# EAGLE design RFM69 USB Gateway 0.9 (EAGLE 7.7.0)
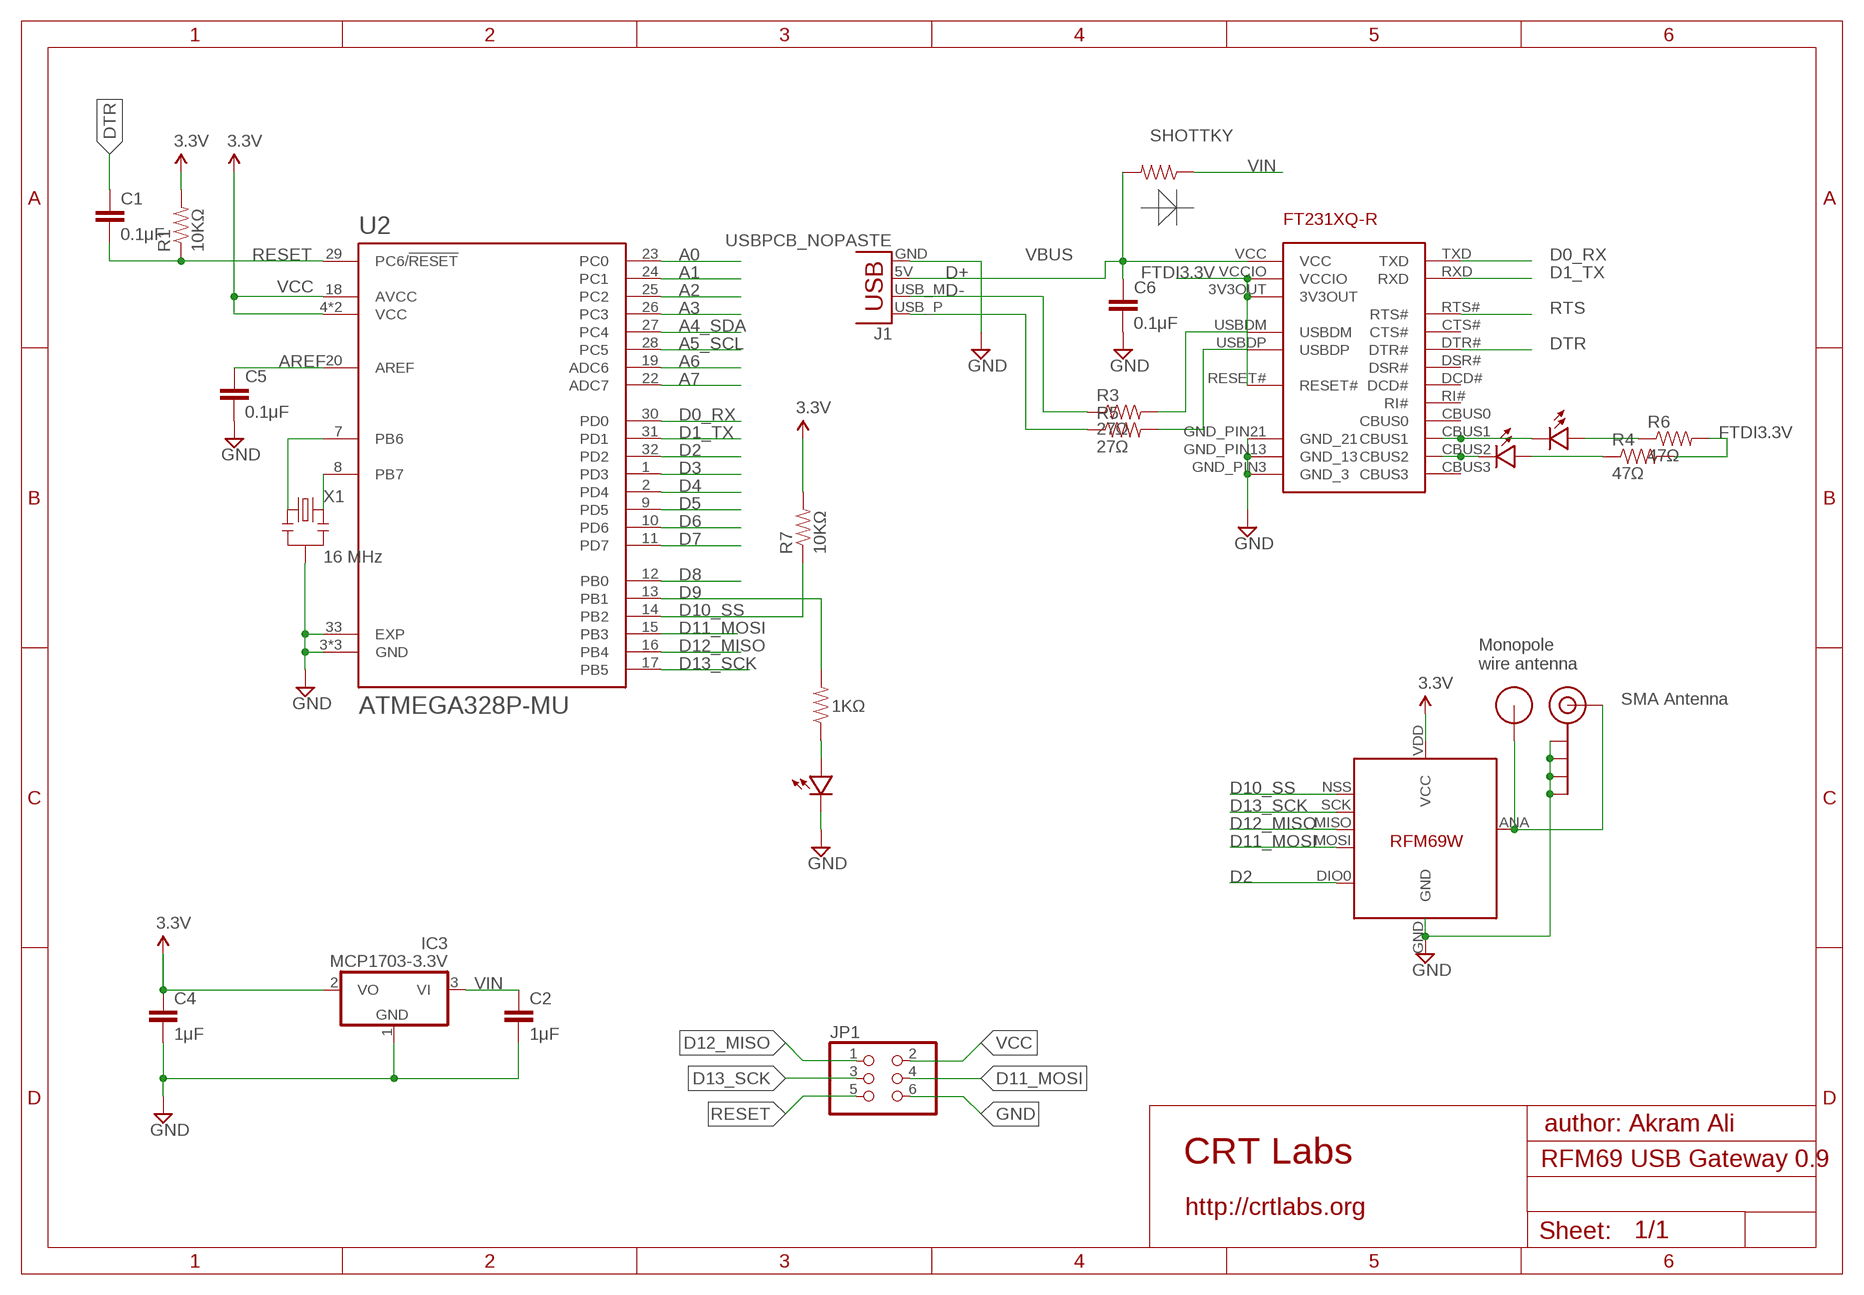
[diagram p0: schematic, sheet 1]

## Parts
C1  0.1μF  CAP0805  [0805]
C2  1μF  CAP0805  [0805]
C4  1μF  CAP0805  [0805]
C5  0.1μF  CAP0805  [0805]
C6  0.1μF  CAP0805  [0805]
D  SHOTTKY  RESISTOR0805  [0805]
FT231XQ-R  FT231XQ-R  [FTDI_FT231XQ-R_PACKAGE]
IC3  MCP1703-3.3V  MCP1703CB  [SOT23]
J1  USBPCB_NOPASTE  [USB-A-PCB-NOPASTE]
J$1  SMA_EDGE  [SMA-EDGE]
JP1  PINHD-2X3  [2X03]
R1  10KΩ  RESISTOR0805  [0805]
R2  1KΩ  RESISTOR0805-RES  [0805]
R3  27Ω  RESISTOR0805-RES  [0805]
R4  47Ω  RESISTOR0805-RES  [0805]
R5  27Ω  RESISTOR0805-RES  [0805]
R6  47Ω  RESISTOR0805-RES  [0805]
R7  10KΩ  RESISTOR0805-RES  [0805]
RX  Green  LED0805  [0805-LED]
TX  Red  LED0805  [0805-LED]
U2  ATMEGA328P-MU  [QFN50P500X500X100-33N]
U$1  RFM12B_ANTENNA  [RFM12B-ANTENNA]
U$2  Status  LED0805  [0805-LED]
U$5  RFM69  [RFM69W-MINPADS]
X1  16 MHz  RESONATORSMD  [RESONATOR-SMD]

## Nets
A0: U2.23(PC0)
A1: U2.24(PC1)
A2: U2.25(PC2)
A3: U2.26(PC3)
A4_SDA: U2.27(PC4)
A5_SCL: U2.28(PC5)
A6: U2.19(ADC6)
A7: U2.22(ADC7)
AREF: C5.1 U2.20(AREF)
D0_RX: FT231XQ-R.TXD U2.30(PD0)
D1_TX: FT231XQ-R.RXD U2.31(PD1)
D2: U2.32(PD2) U$5.DIO0
D3: U2.1(PD3)
D4: U2.2(PD4)
D5: U2.9(PD5)
D6: U2.10(PD6)
D7: U2.11(PD7)
D8: U2.12(PB0)
D9: R2.2 U2.13(PB1)
D10_SS: R7.1 U2.14(PB2) U$5.NSS(SEL)
D11_MOSI: JP1.4 U2.15(PB3) U$5.MOSI
D12_MISO: JP1.1 U2.16(PB4) U$5.MISO
D13_SCK: JP1.3 U2.17(PB5) U$5.SCK
D+: J1.USB_P(D+) R5.1
D-: J1.USB_M(D-) R3.1
DTR: C1.1 FT231XQ-R.DTR#
FTDI3.3V: FT231XQ-R.3V3OUT FT231XQ-R.RESET# FT231XQ-R.VCCIO R4.2 R6.2
GND [power]: C2.2 C4.2 C5.2 C6.2 FT231XQ-R.GND_PIN3(GND_3) FT231XQ-R.GND_PIN13(GND_13) FT231XQ-R.GND_PIN21(GND_21) IC3.1(GND) J1.GND J$1.GND@0(GND) J$1.GND@1(GND) J$1.GND@2(GND) J$1.GND@3(GND) JP1.6 U2.3(GND) U2.5(GND) U2.21(GND) U2.33(EXP) U$2.MINUS U$5.GND X1.2
N$1: U2.7(PB6) X1.1
N$2: R2.1 U$2.PLUS
N$3: J$1.SIG(SIGNAL) U$1.P$1 U$5.ANA(ANT)
N$4: FT231XQ-R.USBDM R3.2
N$5: FT231XQ-R.USBDP R5.2
N$6: FT231XQ-R.CBUS1 RX.MINUS
N$7: FT231XQ-R.CBUS2 TX.MINUS
N$8: R4.1 TX.PLUS
N$9: R6.1 RX.PLUS
N$21: U2.8(PB7) X1.3
RESET: C1.2 JP1.5 R1.1 U2.29(PC6/!RESET)
RTS: FT231XQ-R.RTS#
VBUS [power]: C6.1 D.2 FT231XQ-R.VCC J1.5V(VBUS)
VCC: C4.1 IC3.2(VO) JP1.2 R1.2 R7.2 U2.4(VCC) U2.6(VCC) U2.18(AVCC) U$5.VDD(VCC) ; supply symbol labelled 3.3V
VIN: C2.1 D.1 IC3.3(VI)
Unconnected: FT231XQ-R.CBUS0 FT231XQ-R.CBUS3 FT231XQ-R.CTS# FT231XQ-R.DCD# FT231XQ-R.DSR# FT231XQ-R.RI#

## Notes on the sheet
- Monopole
  wire antenna
- SMA Antenna
- author: Akram Ali
- CRT Labs
- http://crtlabs.org

## Library data of the parts
C1 C2 C5 C6 = SparkFun:CAP: Capacitor Standard 0603 ceramic capacitor, and 0.1" leaded capacitor.
C4 = LowPowerLab:CAP: Capacitor Standard 0603 ceramic capacitor, and 0.1" leaded capacitor.
D R1 = LowPowerLab:RESISTOR: Resistor Basic schematic elements and footprints for 0603, 1206, and PTH resistors.
FT231XQ-R = ftdi_ft231xq-r:FT231XQ-R: This is the 20-LD QFN package of the FTDI FT231XQ-R chip.
IC3 = linear:MCP1703: 250 mA, 16V, Low Quiescent Current LDO Regulator Source: http://ww1.microchip.com/downloads/en/DeviceDoc/22049b.pdf
J1 = SparkFun-Connectors:USB: USB Connectors USB-B-PTH is fully proven SKU : PRT-00139/CONN-08278 USB-miniB is fully proven SKU : PRT-00587 USB-A-PCB is untested. USB-A-H is throughly reviewed, but untested. Spark Fun Electronics SKU : PRT-00437 USB-B-SMT is throughly reviewed, but untested. Needs silkscreen touching up. USB-A-S has not been used/tested USB-MB-H has not been used/tested USB-MICROB has been used. CONN-09505
J$1 = SparkFun-Connectors:SMA_EDGE: SMA Antenna Connector End launch SMA connector. The paste layer has been removed so that the connector can be hand soldered onto the board after reflow.
JP1 = pinhead:PINHD-2X3: PIN HEADER
R2-R7 = SparkFun:RESISTOR: Resistor Basic schematic elements and footprints for 0603, 1206, and PTH resistors.
RX TX U$2 = LowPowerLab:LED
U2 = ATMEGA328P-MU:ATMEGA328P-MU: ATmega Series 20 MHz 32 KB Flash 2 KB SRAM 8-Bit Microcontroller - QFN-32; AVAILABILITY: Good; DESCRIPTION: ATmega Series 20 MHz 32 KB Flash 2 KB SRAM 8-Bit Microcontroller - QFN-32; MF: Atmel; MP: ATMEGA328P-MU; PACKAGE: QFN-32 Atmel; PRICE: 2.55 USD
U$1 = LowPowerLab:RFM12B_ANTENNA
U$5 = LowPowerLab:RFM69
X1 = SparkFun:RESONATOR: Resonator Small SMD resonator. This is the itty bitty 10/20MHz resonators with built in caps. CSTCE10M0G55 and CSTCE20M0V53. Footprint has been reviewed closely but hasn't been tested yet.

## Net classes
1 power: width 0.381 mm, clearance 0.254 mm

## Board
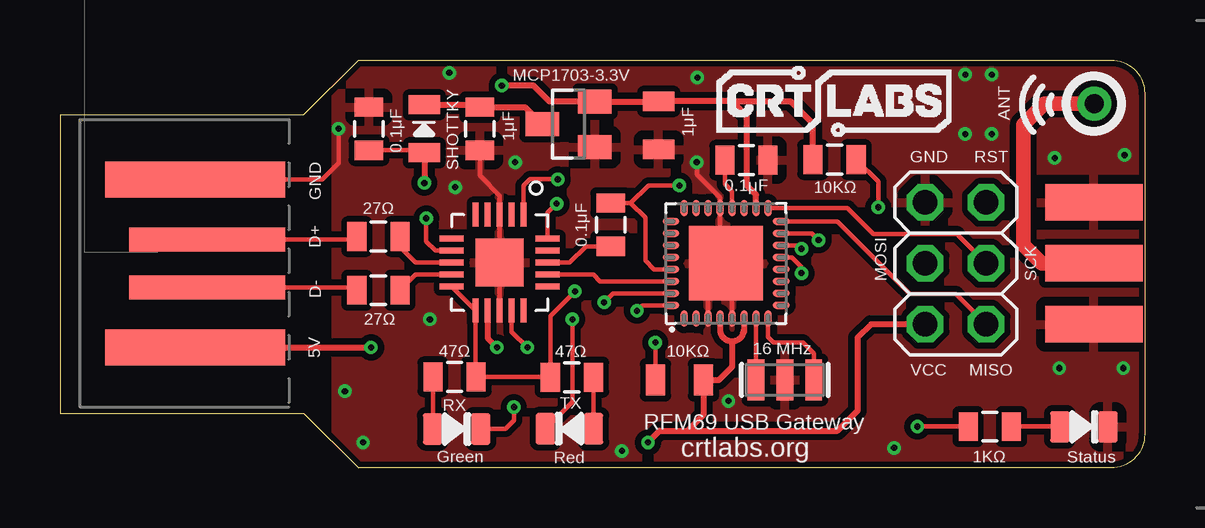
[diagram p1: board, top side]
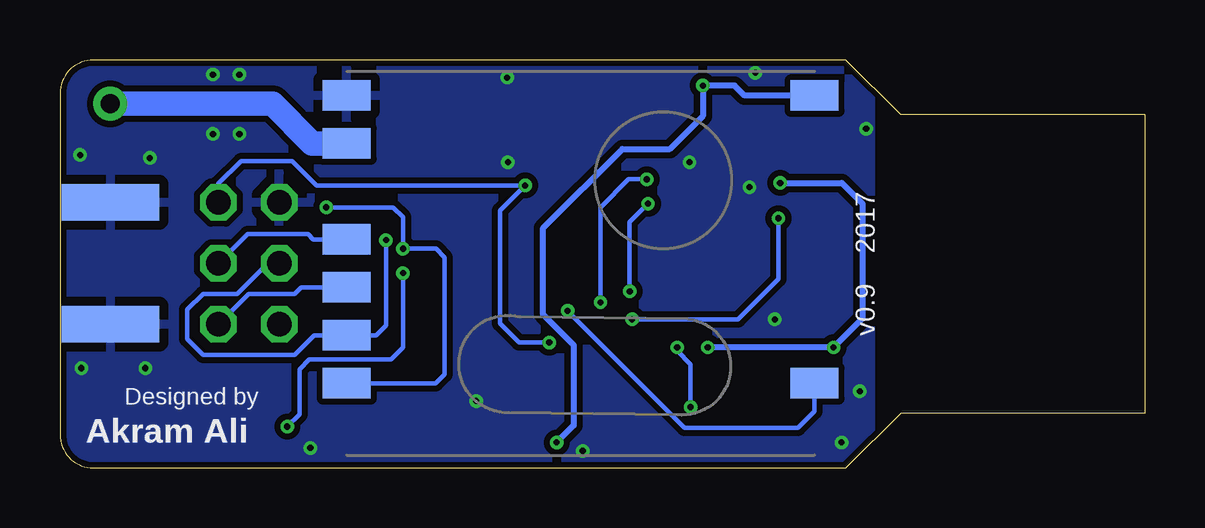
[diagram p2: board, bottom side, seen from below]

Size 45.21 x 17.02 mm. Coordinates in mm from the lower left corner, seen from the top.
Outline: 0,2.29 10.16,2.29 12.45,0 43.81,0 arc90 45.21,1.4 45.21,15.62 arc90 43.81,17.02 12.45,17.02 10.16,14.73 0,14.73 0,2.29
Copper layers (1*16): Top 0.035mm / dielectric 1.5mm / Bottom 0.035mm
Design rules "ITEADstudio_DRC *": minimum track width 6mil, minimum drill 12mil, track to track 6mil, track to pad 6mil, pad to pad 6mil, via to via 6mil, smd to smd 0mil, copper to edge 10mil, drill to drill 10mil, minimum pad ring 10mil, minimum via ring 6mil, stop-mask expansion 2mil, vias tented up to drill 100mil, thermal gap 15mil

### Footprints (pad centres in the part's own frame; a part is rotated, then mirrored left to right if it is on the bottom)
0805 = smd 0.8 x 1.2: 1 -0.9,0; 2 0.9,0
0805' = smd 0.8 x 1.3: 1 -1,0; 2 1,0
FTDI_FT231XQ-R_PACKAGE = smd 0.25 x 1: 3V3OUT 0.968,-2.032; CBUS2 -0.532,-2.032; CBUS3 0.968,1.968; CTS# -1.032,-2.032; DTR# -0.032,1.968; RTS# -0.532,1.968; TXD 0.468,1.968; USBDM 0.468,-2.032; USBDP -0.032,-2.032; VCCIO -1.032,1.968 | smd 1 x 0.25: CBUS0 1.968,0.968; CBUS1 1.968,0.468; DCD# -2.032,-1.032; DSR# -2.032,-0.532; GND_PIN3 -2.032,-0.032; GND_PIN13 1.968,-0.032; RESET# 1.968,-1.032; RI# -2.032,0.468; RXD -2.032,0.968; VCC 1.968,-0.532 | smd 2 x 2: GND_PIN21 -0.032,-0.032
SOT23 = smd 1 x 1.4: 1 -0.95,-1.1; 2 0.95,-1.1; 3 0,1.1
USB-A-PCB-NOPASTE = smd 7.5 x 1.5: 5V -0.2,-3.5; GND -0.2,3.5 | smd 6.5 x 1: USB_M 0.3,-1; USB_P 0.3,1
SMA-EDGE = smd 1.524 x 4.064: GND@0 0,0; GND@1 5.08,0; SIG 2.54,0 | smd 1.524 x 4.064 bottom: GND@2 0,0; GND@3 5.08,0
2X03 = drill 1.016 octagon: 1 -2.54,-1.27; 2 -2.54,1.27; 3 0,-1.27; 4 0,1.27; 5 2.54,-1.27; 6 2.54,1.27
0805-LED = smd 0.8 x 1.3: MINUS -1,0; PLUS 1,0
QFN50P500X500X100-33N = smd 0.7 x 0.3: 1 -2.3,1.75; 2 -2.3,1.25; 3 -2.3,0.75; 4 -2.3,0.25; 5 -2.3,-0.25; 6 -2.3,-0.75; 7 -2.3,-1.25; 8 -2.3,-1.75; 17 2.3,-1.75; 18 2.3,-1.25; 19 2.3,-0.75; 20 2.3,-0.25; 21 2.3,0.25; 22 2.3,0.75; 23 2.3,1.25; 24 2.3,1.75 | smd 0.3 x 0.7: 9 -1.75,-2.3; 10 -1.25,-2.3; 11 -0.75,-2.3; 12 -0.25,-2.3; 13 0.25,-2.3; 14 0.75,-2.3; 15 1.25,-2.3; 16 1.75,-2.3; 25 1.75,2.3; 26 1.25,2.3; 27 0.75,2.3; 28 0.25,2.3; 29 -0.25,2.3; 30 -0.75,2.3; 31 -1.25,2.3; 32 -1.75,2.3 | smd 3.1 x 3.1: 33 0,0
RFM12B-ANTENNA = drill 0.8 pad 1.422: P$1 0,0
RFM69W-MINPADS = smd 2 x 1.27: ANA 8,-5; DIO0 -11.5,5; GND 8,-7; MISO 8,1; MOSI 8,3; NSS 8,5; SCK 8,-1; VDD -11.5,-7
RESONATOR-SMD = smd 0.7 x 1.7: 1 -1.2,0; 2 0,0; 3 1.2,0

### Placement (x,y rotation side)
C1  22.96,10.15 90 top
C2  17.5,14.15 270 top
C4  1μF  [0805']  24.96,14.29 270 top
C5  28.61,12.84 0 top
C6  12.88,14.15 90 top
D  SHOTTKY  [0805']  15.19,14.15 270 top
FT231XQ-R  18.36,8.53 270 top
IC3  21.2,14.34 90 top
J1  5.84,8.53 0 top
J$1  43.1,5.99 90 top
JP1  37.34,8.53 90 top
R1  10KΩ  [0805']  25.82,3.67 0 top
R2  38.76,1.73 180 top
R3  13.27,7.42 0 top
R4  21.34,3.78 180 top
R5  13.27,9.65 0 top
R6  16.45,3.8 0 top
R7  32.28,12.87 180 top
RX  16.54,1.63 180 top
TX  21.23,1.64 0 top
U2  27.76,8.53 90 top
U$1  43.12,15.19 0 top
U$2  42.68,1.71 180 top
U$5  25.26,8.53 180 bottom
X1  30.21,3.67 0 top

### Tracks (layer width: path | path; a pad name or v marks a point on that pad's centre or on a via)
AREF
  Top 0.178: U2.20 28.01,11.54 27.71,11.84 C5.1
D0_RX
  Top 0.178: U2.30 22.52,7.78 22.24,8.07 FT231XQ-R.TXD
D1_TX  (via drill 0.25 pad 0.13)
  Top 0.178: U2.31 23.06,7.28 v22.68,6.91 | FT231XQ-R.RXD 19.33,11.79 19.58,12.04 v20.75,12.04
  Bottom 0.178: v22.68,6.91 22.68,10.87 21.51,12.04 v20.75,12.04
D2  (via drill 0.25 pad 0.13)
  Top 0.178: U2.32 24.28,6.78 v24.05,6.55
  Bottom 0.178: U$5.DIO0 13.76,2.37 14.45,1.68 19.18,1.68 v24.05,6.55
D9  (via drill 0.25 pad 0.13)
  Top 0.178: U2.13 30.51,8.78 30.91,8.38 v30.91,8.13 | v35.74,1.73 R2.2
  Bottom 0.178: v30.91,8.13 30.91,5.03 31.42,4.52 34.82,4.52 35.23,4.12 35.23,2.24 v35.74,1.73
D10_SS  (via drill 0.25 pad 0.13)
  Top 0.178: U2.14 30.77,9.28 v30.91,9.14 | R7.1 34.11,11.94 v34.11,10.87
  Bottom 0.178: U$5.NSS 29.56,3.53 29.18,3.91 29.18,8.79 29.54,9.14 v30.91,9.14 30.91,10.46 31.32,10.87 v34.11,10.87
D11_MOSI  (via drill 0.25 pad 0.13)
  Top 0.178: U2.15 31.34,9.78 v31.62,9.5
  Bottom 0.178: JP1.4 36.55,8.53 37.82,7.26 39.24,7.26 39.9,6.6 39.9,5.38 39.24,4.72 35.43,4.72 34.62,5.54 U$5.MOSI 32.03,5.54 31.62,5.94 v31.62,9.5
D12_MISO
  Top 0.178: U2.16 32.41,10.28 35.43,7.26 37.34,7.26 JP1.1
  Bottom 0.178: U$5.MISO 35.16,7.53 35.43,7.26 37.34,7.26 JP1.1
D13_SCK
  Top 0.178: JP1.3 37.39,9.75 33.91,9.75 32.83,10.83 U2.17
  Bottom 0.178: U$5.SCK 34.66,9.53 34.87,9.75 37.39,9.75 JP1.3
D+
  Top 0.178: R5.1 12.25,9.53 J1.USB_P
D-
  Top 0.178: R3.1 12.25,7.53 J1.USB_M
DTR
  Top 0.178: FT231XQ-R.DTR# 21.24,8.57 21.92,9.25 C1.1
FTDI3.3V  (via drill 0.25 pad 0.13)
  Top 0.178: FT231XQ-R.3V3OUT FT231XQ-R.RESET# 17.33,3.81 R6.2 20.42,3.8 R4.2 20.45,3.8 20.45,6.35 v21.46,7.37 | FT231XQ-R.VCCIO 20.33,10.65 v20.7,11.02
  Bottom 0.178: v21.46,7.37 21.46,10.26 v20.7,11.02
GND  (via drill 0.25 pad 0.13)
  Top 0.178: FT231XQ-R.GND_PIN13 FT231XQ-R.GND_PIN21 FT231XQ-R.GND_PIN3 18.33,11.36 17.5,12.19 C2.2 | U2.33 27.51,8.78 U2.21 27.51,11.27 26.54,12.24 v26.54,12.75 | U2.5 28.01,8.28 U2.33 | U2.3 27.01,7.78 U2.33 | J1.GND 10.92,12.03 11.61,12.72 v11.61,14.15
  other vias: 27.86,2.79 18.97,12.75 11.87,3.2 44.32,4.17 44.37,13.06 15.42,6.2 37.73,16.41 38.84,16.41 26.57,16.28 16.23,16.48 12.64,1.07 23.42,0.71 34.77,0.84 41.66,4.17 41.47,12.93 16.47,11.71 38.84,13.93 37.73,13.93
  pour Bottom: 11.43,16.89 11.43,-0.13 46.23,-0.01 46.23,17.01
  pour Top: 11.48,16.85 11.48,-0.17 46.08,-0.09 46.08,16.93
N$1
  Top 0.178: U2.7 X1.1
N$2
  Top 0.178: R2.1 41.67,1.73 U$2.PLUS
N$3
  Top 0.61: J$1.SIG 40.92,8.53 40.16,9.3 40.16,14.33 41.02,15.19 U$1.P$1
  Bottom 1.016: U$5.ANA 34.69,13.53 36.35,15.19 U$1.P$1
N$4
  Top 0.178: FT231XQ-R.USBDM 14.82,8.07 R3.2
N$5
  Top 0.178: FT231XQ-R.USBDP 14.83,8.57 14.17,9.22 R5.2
N$6  (via drill 0.25 pad 0.13)
  Top 0.178: FT231XQ-R.CBUS1 18.83,5.68 v19.48,5.03 | RX.MINUS 18.57,1.63 18.92,1.98 v18.92,2.54
  Bottom 0.178: v19.48,5.03 19.48,4.88 18.92,4.32 v18.92,2.54
N$7  (via drill 0.25 pad 0.13)
  Top 0.178: FT231XQ-R.CBUS2 15.65,9.07 15.26,9.45 v15.26,10.41 | TX.MINUS 21.36,2.76 v21.36,6.2
  Bottom 0.178: v15.26,10.41 15.26,7.87 16.94,6.2 v21.36,6.2
N$8
  Top 0.178: TX.PLUS R4.1
N$9
  Top 0.178: R6.1 15.55,1.64 RX.PLUS
N$21
  Top 0.178: U2.8 29.51,5.46 29.74,5.23 30.96,5.23 31.42,4.78 X1.3
RESET  (via drill 0.25 pad 0.13)
  Top 0.178: U2.29 24.76,8.28 24.4,8.65 24.4,10.44 23.79,11.05 | C1.2 23.79,11.05 | R1.1 v24.82,5.23 | v25.82,11.79 24.53,11.79 23.79,11.05
  Bottom 0.178: JP1.5 38.61,11.86 37.67,12.8 35.53,12.8 34.52,11.79 v25.82,11.79 26.87,10.73 26.87,6.02 26.09,5.23 v24.82,5.23
VBUS  (via drill 0.25 pad 0.13)
  Top 0.178: C6.1 15.09,13.25 D.2 | J1.5V
  Top 0.254: FT231XQ-R.VCC 17.83,5.41 v18.21,5.03 | D.2 v15.19,11.89 | J1.5V v12.97,5.03
  Bottom 0.254: v15.19,11.89 12.62,11.89 11.76,11.02 11.76,6.24 v12.97,5.03 v18.21,5.03
VCC  (via drill 0.25 pad 0.13)
  Top 0.178: C4.1 | R1.2 26.83,3.66 | 28.51,5.78 U2.6
  Top 0.254: C4.1 IC3.2 20.4,15.29 19.74,15.95 v18.41,15.95 | U2.18 29.01,11.4 28.63,11.79 28.63,14.68 28.02,15.29 | 28.02,15.29 C4.1 | R7.2 31.38,14.36 30.45,15.29 28.02,15.29 | U2.4 27.51,5.79 arc90 28.02,5.28 | 28.02,5.28 arc90 28.51,5.78 | 28.02,5.28 28.02,4.22 27.46,3.66 26.83,3.66 | JP1.2 33.81,5.99 33.25,5.44 33.25,2.39 32.41,1.55 26.16,1.55 | U2.6 28.51,5.68 | v24.51,1.07 24.99,1.55 26.16,1.55 | R1.2 26.82,2.21 26.16,1.55
  Bottom 0.254: U$5.VDD 16.68,15.53 17.09,15.95 v18.41,15.95 18.41,14.68 19.79,13.31 21.77,13.31 25.07,10.01 25.07,6.4 23.8,5.13 23.8,1.78 v24.51,1.07
VIN
  Top 0.178: 17.4,15.15 C2.1
  Top 0.254: D.1 17.4,15.15 | C2.1 19.39,15.05 IC3.3

### Text on the board
tPlace: ANT | RFM69 USB Gateway | crtlabs.org
bPlace: v0.9 2017 | Designed by | Akram Ali
tDocu: All dimensions in mils | Moteino-USB
_tsilk: GND | GND | RST | D+ | SCK | MOSI | D- | 5V | VCC | MISO